# Altium project Yitran_IT900_Hutschiene_PIM7A_908_1_4_und_Adapter.PrjPcb
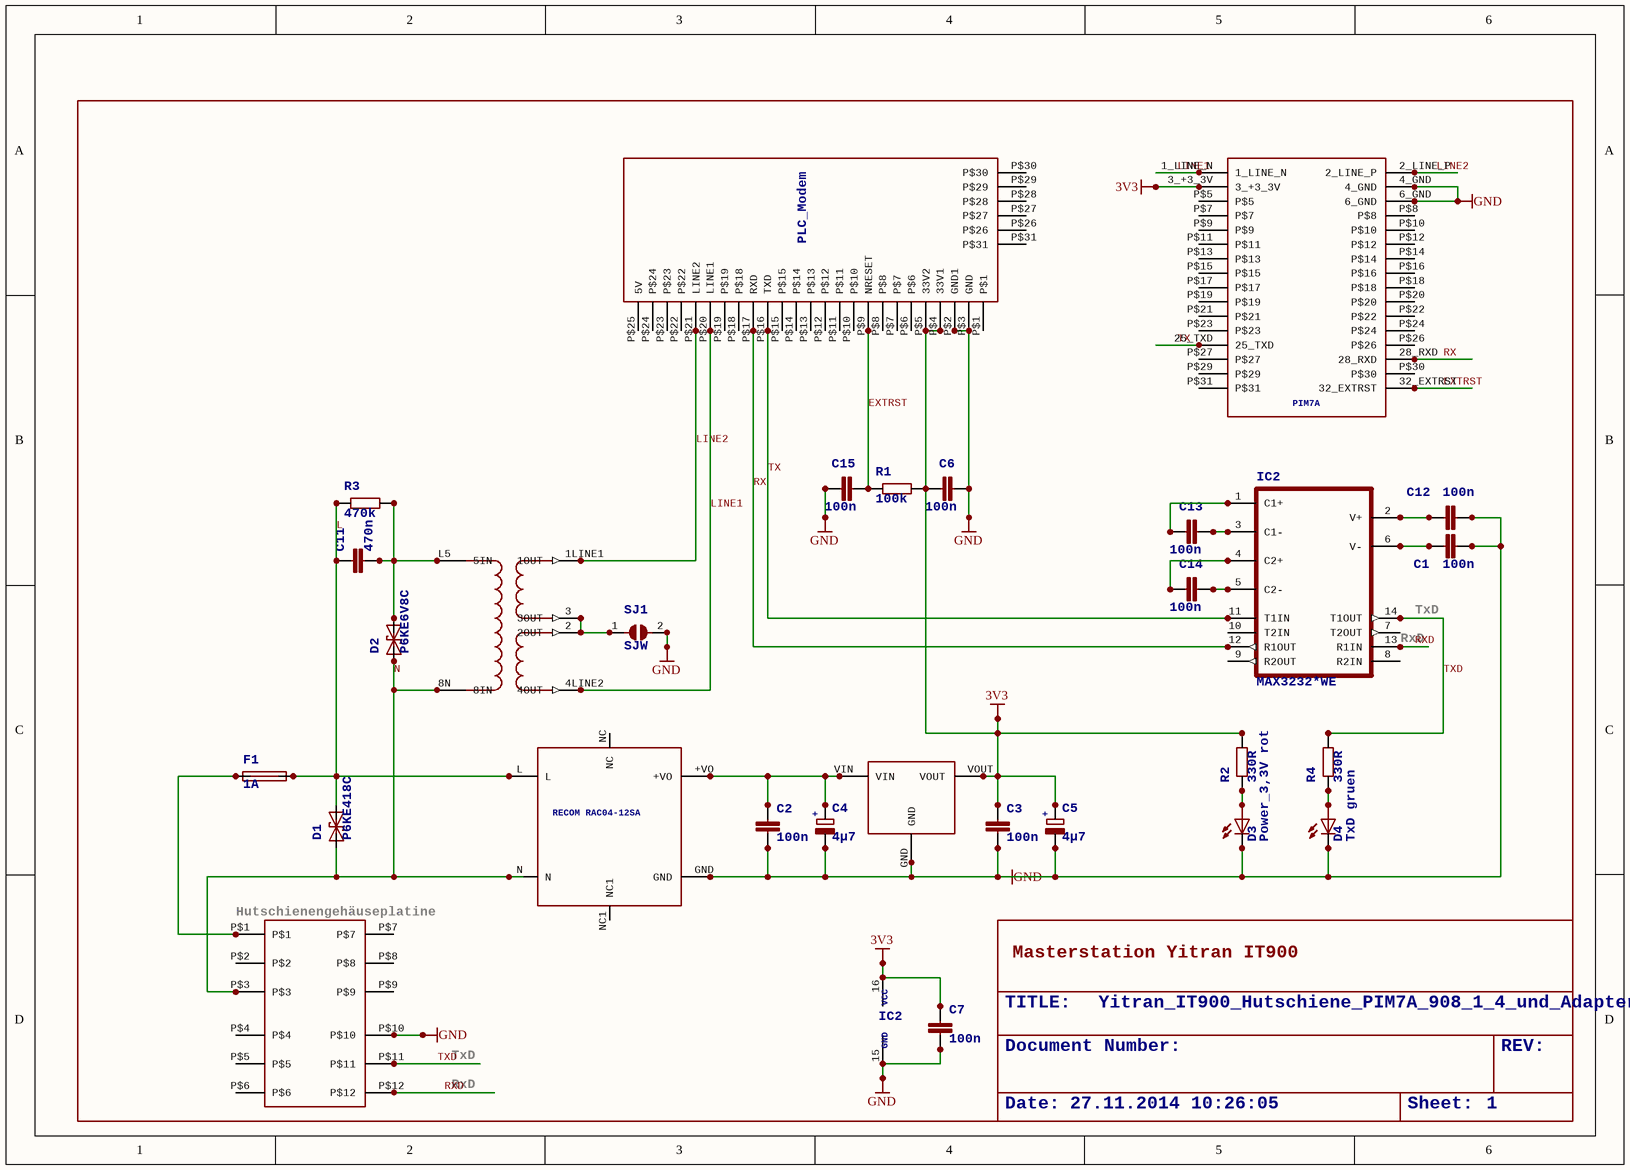
[diagram p0: Yitran_IT900_Hutschiene_PIM7A_908_1_4_und_Adapter_0.SchDoc]
3 sheets, 35 parts. Net scope: global (net labels, ports and power ports of the same name join across sheets).
Board file: Yitran_IT900_Hutschiene_PIM7A_908_1_4_und_Adapter.PcbDoc
Sheets:
  Yitran_IT900_Hutschiene_PIM7A_908_1_4_und_Adapter_0.SchDoc
  Yitran_IT900_Hutschiene_PIM7A_908_1_4_und_Adapter_1.SchDoc
  Yitran_IT900_Hutschiene_PIM7A_908_1_4_und_Adapter_2.SchDoc

## Sheet Yitran_IT900_Hutschiene_PIM7A_908_1_4_und_Adapter_0.SchDoc: TITLE:
size 286 x 204 mm; Date: Date:; >LAST_DATE_TIME: 27.11.2014 10:26:05; Sheet:: Sheet:; >SHEET: 1; REV:: REV:; Document Number:: Document Number:; >DRAWING_NAME: Yitran_IT900_Hutschiene_PIM7A_908_1_4_und_Adapter.sch

### Parts
C1  100n  [C1206K]
C2  >NAME: C2  [C1206K]  (hidden comment: 100n)
C3  >NAME: C3  [C1206K]  (hidden comment: 100n)
C4  >NAME: C4  [E2,5-5]  (hidden comment: 4µ7)
C5  >NAME: C5  [E2,5-5]  (hidden comment: 4µ7)
C6  100n  [C1206K]
C7  >NAME: C7  [C1206K]  (hidden comment: 100n)
C11  >NAME: C11  [C150-091X182]  (hidden comment: 470n)
C12  100n  [C1206K]
C13  100n  [C1206K]
C14  100n  [C1206K]
C15  100n  [C1206K]
D1  >NAME: D1  [CB417-15]  (hidden comment: P6KE418C)
D2  >NAME: D2  [CB417-15]  (hidden comment: P6KE6V8C)
D3  >NAME: D3  [HLMP6]  (hidden comment: Power_3,3V rot)
D4  >NAME: D4  [HLMP6]  (hidden comment: TxD gruen)
F1  >NAME: F1  [TR5]  (hidden comment: 1A)
IC2  >NAME: IC2  [SO16L]  (hidden comment: MAX3232*WE)  (parts A,B of 2)
R1  >NAME: R1  [M1406]  (hidden comment: 100k)
R2  >NAME: R2  [R1206]  (hidden comment: 330R)
R3  >NAME: R3  [0309/10]  (hidden comment: 470k)
R4  >NAME: R4  [R1206]  (hidden comment: 330R)
SJ1  >NAME: SJ1  [SJW]  (hidden comment: SJW)
U$1  RECOM_783_3  [RECOM785X]  (value not drawn)
U$2  LDG-A-12  [LDG-A-12]  (value not drawn)
U$3  MODEMSTECKER  [MODEM_FUSS]  (value not drawn)
U$4  IT900PIM7A  [IT900PIM7A]  (value not drawn)
U$9  RECOM_RAC04_12SA  [RAC04_12SA]  (value not drawn)
U$10  PLC_UEBERTRAGER_V2  [PLC-UEBERTRAGER_V2]  (value not drawn)

### Nets
3V3: C3.1 C5.+ C6.1 C7.1 IC2.16(VCC) R1.2 R2.2 U$1.VOUT U$3.P$4(33V1) U$3.P$5(33V2) U$4.3_+3_3V
GND: C1.2 C2.2 C3.2 C4.- C5.- C6.2 C7.2 C12.2 C15.1 D3.K D4.K IC2.15(GND) SJ1.2 U$1.GND U$2.P$10 U$3.P$2(GND1) U$3.P$3(GND) U$4.4_GND U$4.6_GND U$9.GND
EXTRST: C15.2 R1.1 U$3.P$9(NRESET) U$4.32_EXTRST
L: C11.1 D1.C F1.2 R3.1 U$9.L
LINE1: U$3.P$20(LINE1) U$4.1_LINE_N U$10.4LINE2(4OUT)
LINE2: U$3.P$21(LINE2) U$4.2_LINE_P U$10.1LINE1(1OUT)
N: D1.A D2.A U$2.P$3 U$9.N U$10.8N(8IN)
RX: IC2.12(R1OUT) U$3.P$17(RXD) U$4.28_RXD
RXD: IC2.13(R1IN) U$2.P$12
TX: IC2.11(T1IN) U$3.P$16(TXD) U$4.25_TXD
TXD: IC2.14(T1OUT) R4.2 U$2.P$11
NetC1_1: C1.1 IC2.6(V-)
NetC2_1: C2.1 C4.+ U$1.VIN U$9.+VO
NetC11_2: C11.2 D2.C R3.2 U$10.L5(5IN)
NetC12_1: C12.1 IC2.2(V+)
NetC13_1: C13.1 IC2.1(C1+)
NetC13_2: C13.2 IC2.3(C1-)
NetC14_1: C14.1 IC2.4(C2+)
NetC14_2: C14.2 IC2.5(C2-)
NetD3_A: D3.A R2.1
NetD4_A: D4.A R4.1
NetF1_1: F1.1 U$2.P$1
NetSJ1_1: SJ1.1 U$10.2(2OUT) U$10.3(3OUT)

Not connected (* = marked no-connect by the designer): IC2 7(T2OUT) 8(R2IN) 9(R2OUT) 10(T2IN); U$2 P$2 P$4 P$5 P$6 P$7 P$8 P$9; U$3 P$1 P$6 P$7 P$8 P$10 P$11 P$12 P$13 P$14 P$15 P$18 P$19 P$22 P$23 P$24 P$25(5V) P$26 P$27 P$28 P$29 P$30 P$31; U$4 P$5 P$7 P$8 P$9 P$10 P$11 P$12 P$13 P$14 P$15 P$16 P$17 P$18 P$19 P$20 P$21 P$22 P$23 P$24 P$26 P$27 P$29 P$30 P$31; U$9 NC NC1

### Notes on the sheet
- TxD
- (near IC2) RxD
- (near U$2) Hutschienengehäuseplatine
- Masterstation Yitran IT900
- RxD

### Library data of the parts
C1-C3 C6 C7 C12-C15 = C-EUC1206K: <B>CAPACITOR</B>, European symbol
  C2 C3 C7: >VALUE: 100n
C4 C5 = CPOL-EUE2.5-5: <B>POLARIZED CAPACITOR</B>, European symbol; +: +; >VALUE: 4µ7
C11 = C-EU150-091X182: <B>CAPACITOR</B>, European symbol; >VALUE: 470n
D1 D2 = P6KEXXC: <B>DIODE</B><p> / transient-voltage suppressor
  D1: >VALUE: P6KE418C
  D2: >VALUE: P6KE6V8C
D3 D4 = HLMP6: <b>LED</b><p> / 2mm horizontal; MF: AGILENT TECHNOLOGIES; MPN: HLMP-6500; OC_FARNELL: 1652490; OC_NEWARK: 40K0088
  D3: >VALUE: Power_3,3V rot
  D4: >VALUE: TxD gruen
F1 = TR5: <b>FUSE</b><p> / Wickmann; OC_FARNELL: unknown; OC_NEWARK: unknown; >VALUE: 1A
IC2 = MAX3232*WE: <b>True RS-232 Transceivers</b> 3.0V to 5.5V, Low-Power<p> / up to 1Mbps,  Using Four 0.1µF External Capacitors<br> / Source: http://pdfserv.maxim-ic.com/en/ds/MAX3222-MAX3241.pdf; MPN: MAX3232EWE+; OC_FARNELL: unknown; OC_NEWARK: 67K4863; >VALUE: MAX3232*WE
R1 = R-EU_M1406: <B>RESISTOR</B>, European symbol; >VALUE: 100k
R2 R4 = R-EU_R1206: <B>RESISTOR</B>, European symbol; >VALUE: 330R
R3 = R-EU_0309/10: <B>RESISTOR</B>, European symbol; >VALUE: 470k
SJ1 = SJW: SMD solder <b>JUMPER</b>; >VALUE: SJW
U$1 = RECOM_785_05
U$3 = MODEMSTECKER: PLC_Modem: PLC_Modem
U$4 = IT900PIM7A: PIM7A: PIM7A
U$9 = RECOM_RAC04_12SA: RECOM RAC04-12SA: RECOM RAC04-12SA

## Sheet Yitran_IT900_Hutschiene_PIM7A_908_1_4_und_Adapter_1.SchDoc
size 286 x 202 mm
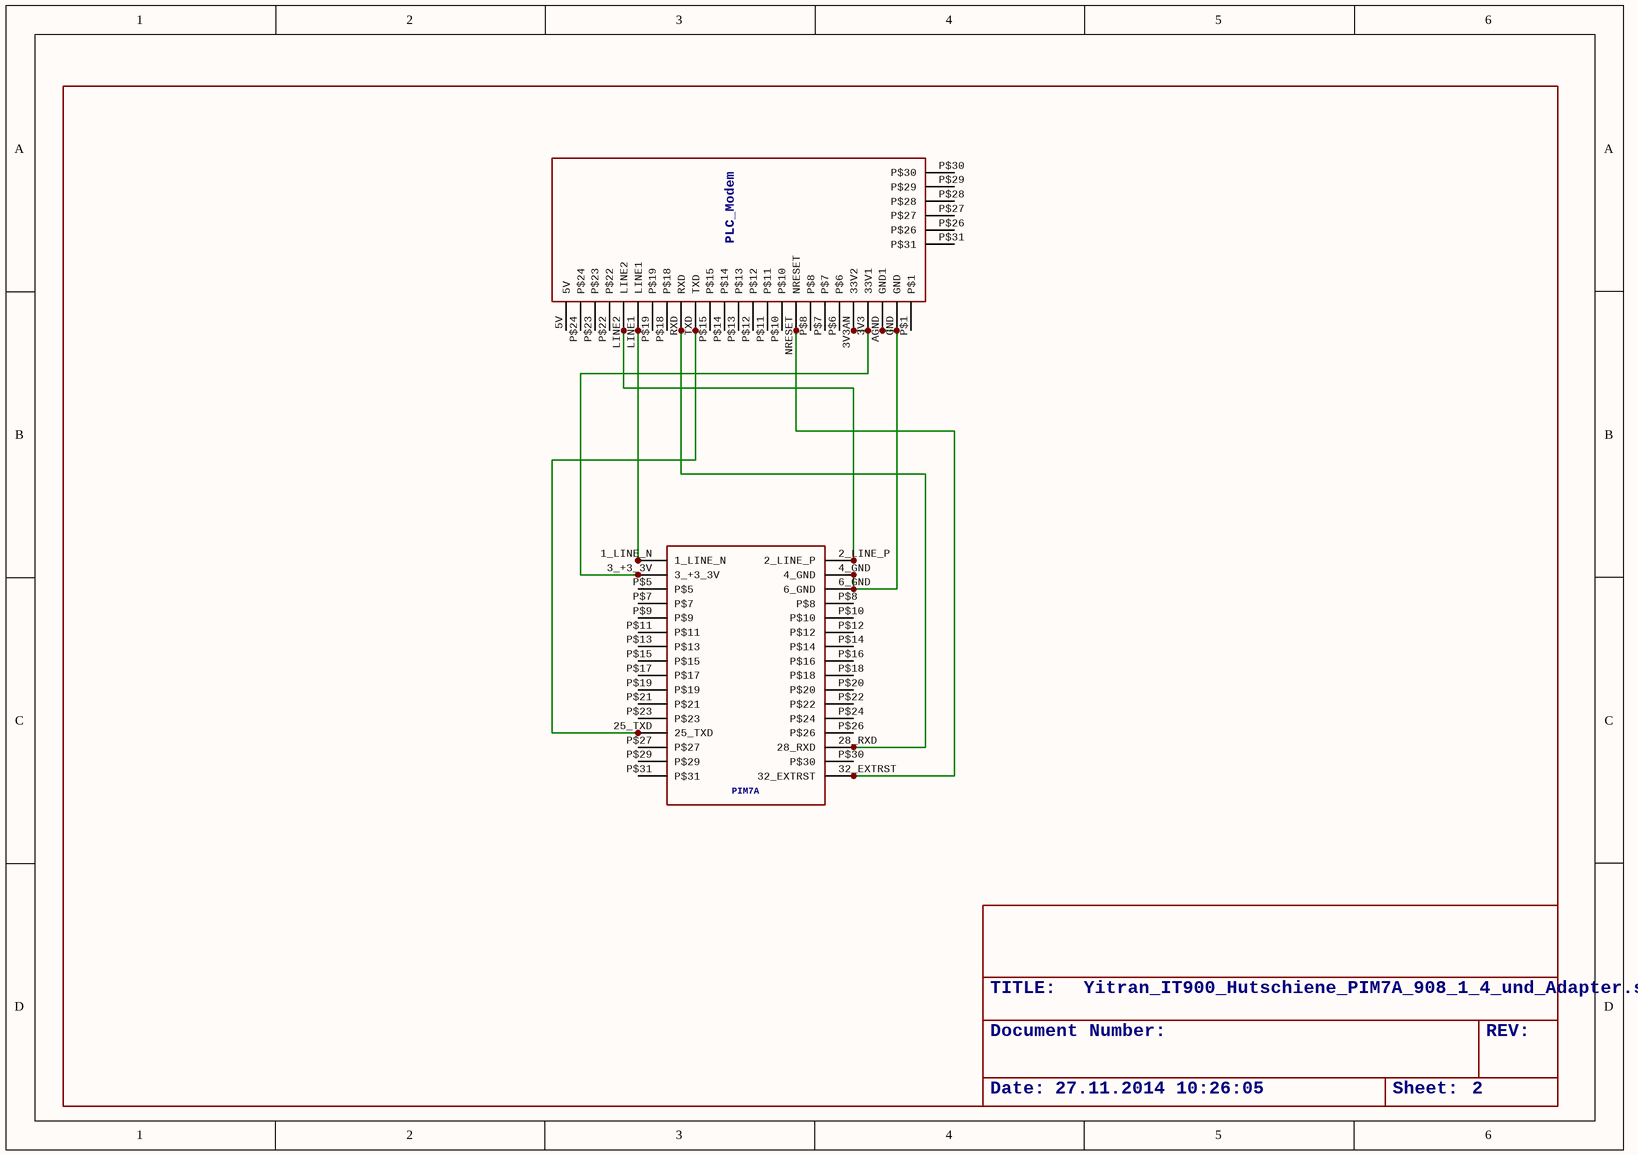
[diagram p1: Yitran_IT900_Hutschiene_PIM7A_908_1_4_und_Adapter_1.SchDoc]

### Parts
FRAME2  DINA4_L  (value not drawn)  (parts A,B of 2)
U$5  MODEMSTECKER_KLEINE_PINS  [MODEM_FUSS_KLEINE_PINS]  (value not drawn)
U$6  IT900PIM7A  [IT900PIM7A]  (value not drawn)

### Nets
NetU$5_3V3: U$5.3V3(33V1) U$5.3V3AN(33V2) U$6.3_+3_3V
NetU$5_AGND: U$5.AGND(GND1) U$5.GND U$6.4_GND U$6.6_GND
NetU$5_LINE1: U$5.LINE1 U$6.1_LINE_N
NetU$5_LINE2: U$5.LINE2 U$6.2_LINE_P
NetU$5_NRESET: U$5.NRESET U$6.32_EXTRST
NetU$5_RXD: U$5.RXD U$6.28_RXD
NetU$5_TXD: U$5.TXD U$6.25_TXD

Not connected (* = marked no-connect by the designer): U$5 5V P$1 P$6 P$7 P$8 P$10 P$11 P$12 P$13 P$14 P$15 P$18 P$19 P$22 P$23 P$24 P$26 P$27 P$28 P$29 P$30 P$31; U$6 P$5 P$7 P$8 P$9 P$10 P$11 P$12 P$13 P$14 P$15 P$16 P$17 P$18 P$19 P$20 P$21 P$22 P$23 P$24 P$26 P$27 P$29 P$30 P$31

### Library data of the parts
FRAME2 = DINA4_L: <b>FRAME</b><p> / DIN A4, landscape with extra doc field
U$5 = MODEMSTECKER_KLEINE_PINS: PLC_Modem: PLC_Modem
U$6 = IT900PIM7A: PIM7A: PIM7A

## Sheet Yitran_IT900_Hutschiene_PIM7A_908_1_4_und_Adapter_2.SchDoc
size 286 x 202 mm
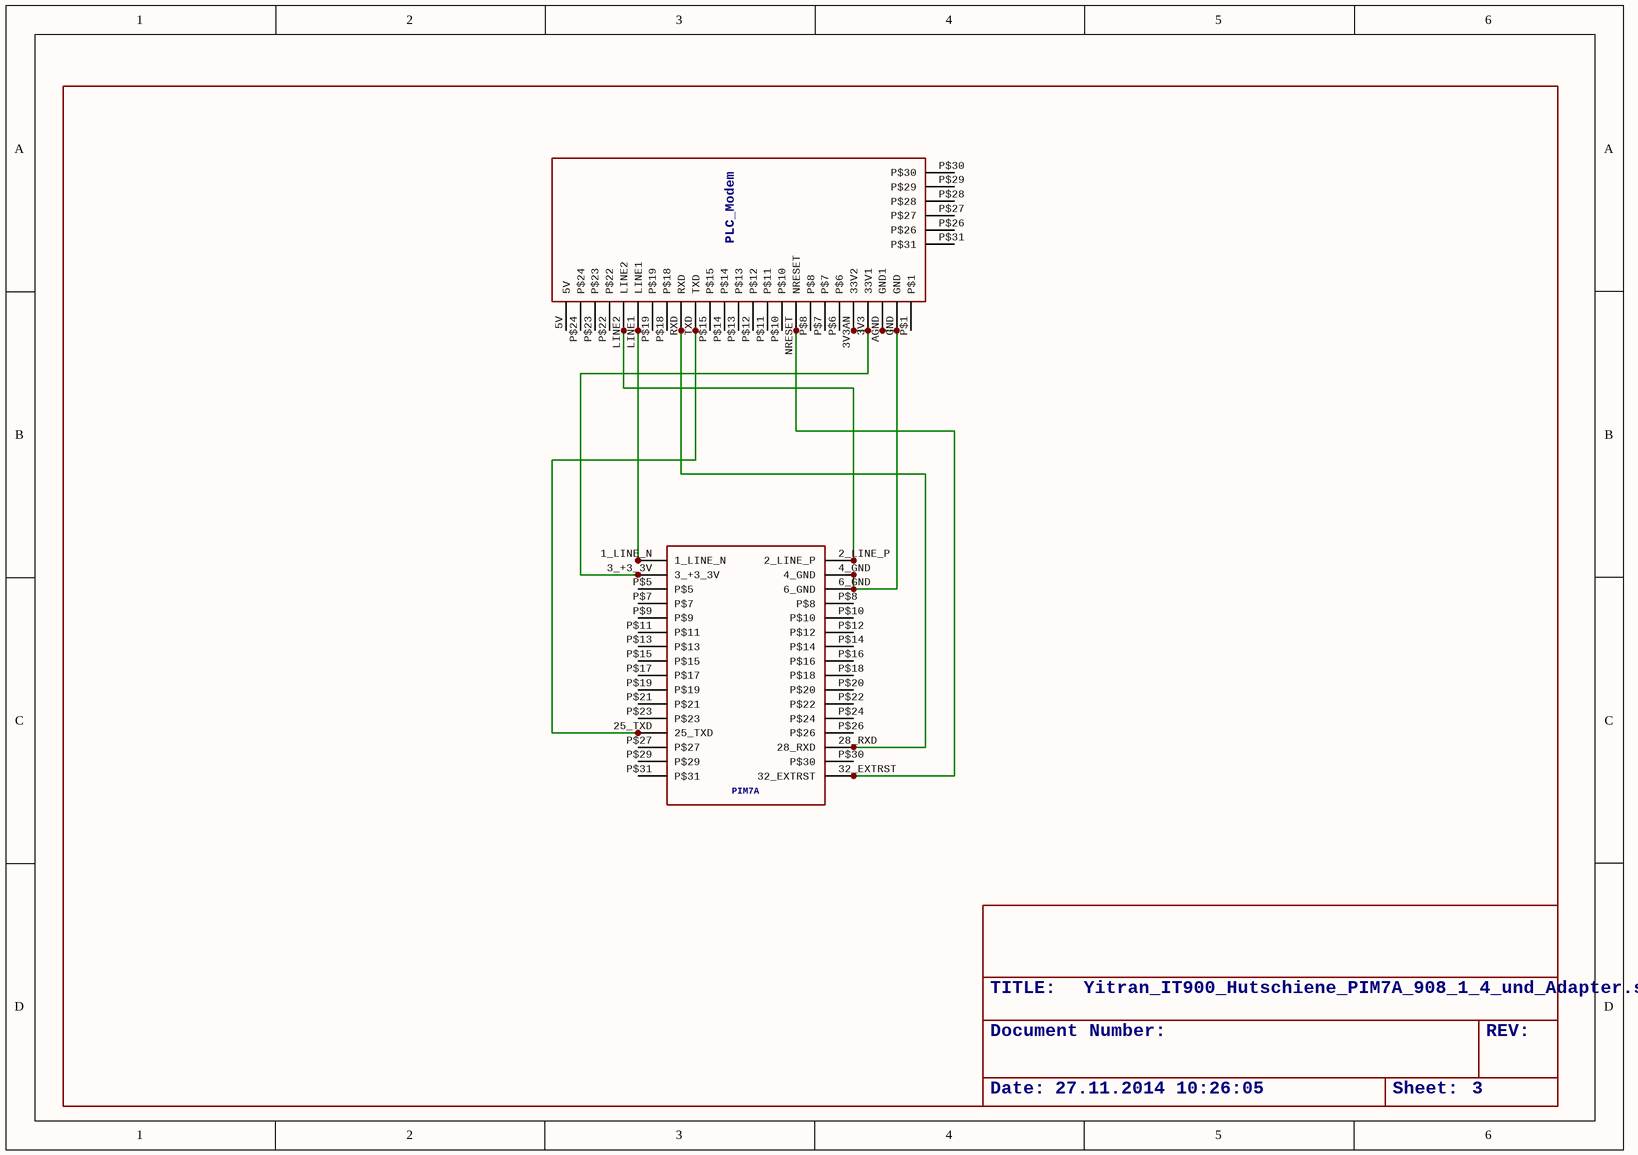
[diagram p2: Yitran_IT900_Hutschiene_PIM7A_908_1_4_und_Adapter_2.SchDoc]

### Parts
FRAME3  DINA4_L  (value not drawn)  (parts A,B of 2)
U$7  MODEMSTECKER_KLEINE_PINS  [MODEM_FUSS_KLEINE_PINS]  (value not drawn)
U$8  IT900PIM7A  [IT900PIM7A]  (value not drawn)

### Nets
NetU$7_3V3: U$7.3V3(33V1) U$7.3V3AN(33V2) U$8.3_+3_3V
NetU$7_AGND: U$7.AGND(GND1) U$7.GND U$8.4_GND U$8.6_GND
NetU$7_LINE1: U$7.LINE1 U$8.1_LINE_N
NetU$7_LINE2: U$7.LINE2 U$8.2_LINE_P
NetU$7_NRESET: U$7.NRESET U$8.32_EXTRST
NetU$7_RXD: U$7.RXD U$8.28_RXD
NetU$7_TXD: U$7.TXD U$8.25_TXD

Not connected (* = marked no-connect by the designer): U$7 5V P$1 P$6 P$7 P$8 P$10 P$11 P$12 P$13 P$14 P$15 P$18 P$19 P$22 P$23 P$24 P$26 P$27 P$28 P$29 P$30 P$31; U$8 P$5 P$7 P$8 P$9 P$10 P$11 P$12 P$13 P$14 P$15 P$16 P$17 P$18 P$19 P$20 P$21 P$22 P$23 P$24 P$26 P$27 P$29 P$30 P$31

### Library data of the parts
FRAME3 = DINA4_L: as FRAME2 on sheet Yitran_IT900_Hutschiene_PIM7A_908_1_4_und_Adapter_1
U$7 = MODEMSTECKER_KLEINE_PINS: PLC_Modem: PLC_Modem
U$8 = IT900PIM7A: PIM7A: PIM7A